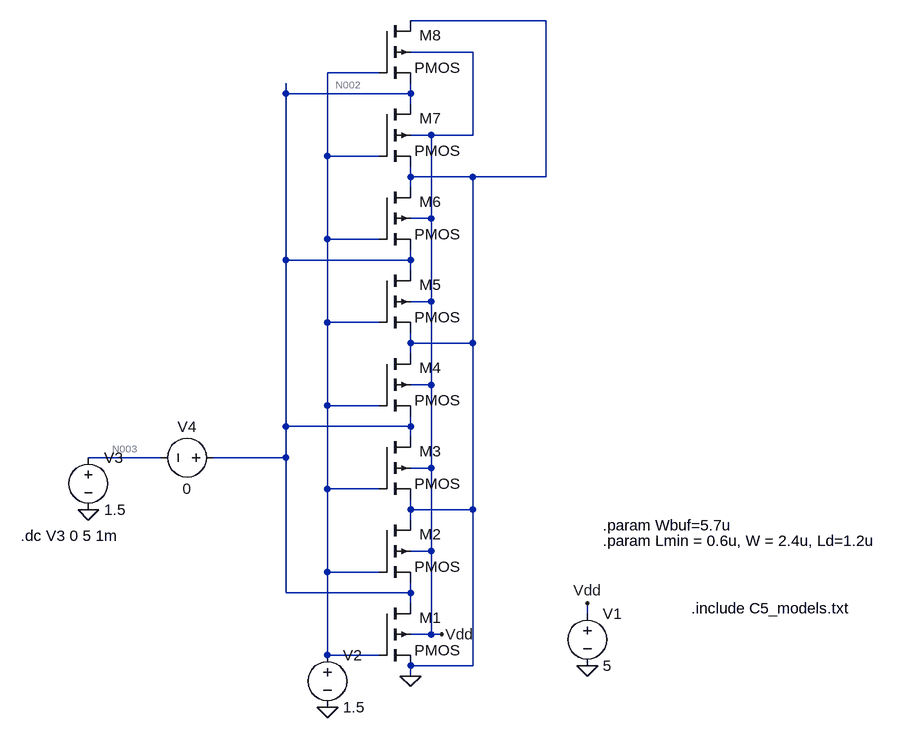
[diagram p0: schematic buffer.asc]
buffer.asc, the LTspice schematic file:
Version 4
SHEET 1 1016 680
WIRE 464 -768 256 -768
WIRE 352 -720 256 -720
WIRE 208 -688 128 -688
WIRE 64 -656 64 -672
WIRE 256 -656 256 -672
WIRE 256 -656 64 -656
WIRE 256 -640 256 -656
WIRE 288 -592 256 -592
WIRE 352 -592 352 -720
WIRE 352 -592 288 -592
WIRE 128 -560 128 -688
WIRE 208 -560 128 -560
WIRE 256 -528 256 -544
WIRE 352 -528 256 -528
WIRE 464 -528 464 -768
WIRE 464 -528 352 -528
WIRE 256 -512 256 -528
WIRE 288 -464 288 -592
WIRE 288 -464 256 -464
WIRE 128 -432 128 -560
WIRE 208 -432 128 -432
WIRE 64 -400 64 -656
WIRE 256 -400 256 -416
WIRE 256 -400 64 -400
WIRE 256 -384 256 -400
WIRE 288 -336 288 -464
WIRE 288 -336 256 -336
WIRE 128 -304 128 -432
WIRE 208 -304 128 -304
WIRE 256 -272 256 -288
WIRE 352 -272 352 -528
WIRE 352 -272 256 -272
WIRE 256 -256 256 -272
WIRE 288 -208 288 -336
WIRE 288 -208 256 -208
WIRE 128 -176 128 -304
WIRE 208 -176 128 -176
WIRE 64 -144 64 -400
WIRE 256 -144 256 -160
WIRE 256 -144 64 -144
WIRE 256 -128 256 -144
WIRE -128 -96 -240 -96
WIRE 64 -96 64 -144
WIRE 64 -96 -48 -96
WIRE 288 -80 288 -208
WIRE 288 -80 256 -80
WIRE 128 -48 128 -176
WIRE 208 -48 128 -48
WIRE 256 -16 256 -32
WIRE 352 -16 352 -272
WIRE 352 -16 256 -16
WIRE 256 0 256 -16
WIRE 288 48 288 -80
WIRE 288 48 256 48
WIRE 128 80 128 -48
WIRE 208 80 128 80
WIRE 64 112 64 -96
WIRE 256 112 256 96
WIRE 256 112 64 112
WIRE 256 128 256 112
WIRE 528 144 528 128
WIRE 288 176 288 48
WIRE 288 176 256 176
WIRE 304 176 288 176
WIRE 128 208 128 80
WIRE 208 208 128 208
WIRE 352 224 352 -16
WIRE 352 224 256 224
WIRE 256 240 256 224
FLAG 304 176 Vdd
FLAG 256 240 0
FLAG 528 224 0
FLAG 528 128 Vdd
FLAG 128 288 0
FLAG -240 -16 0
SYMBOL pmos4 208 128 R0
WINDOW 0 62 22 Left 2
WINDOW 3 54 72 Left 2
SYMATTR InstName M1
SYMATTR Value2 l='Lmin' w='Wbuf' ad='Ld*Wbuf' as='Ld*Wbuf' pd='2*Ld+2*Wbuf' ps='2*Ld+2*Wbuf' m=1
SYMBOL voltage 528 128 R0
SYMATTR InstName V1
SYMATTR Value 5
SYMBOL voltage 128 192 R0
SYMATTR InstName V2
SYMATTR Value 1.5
SYMBOL voltage -240 -112 R0
SYMATTR InstName V3
SYMATTR Value 1.5
SYMBOL pmos4 208 0 R0
WINDOW 0 62 22 Left 2
WINDOW 3 54 72 Left 2
SYMATTR InstName M2
SYMATTR Value2 l='Lmin' w='Wbuf' ad='Ld*Wbuf' as='Ld*Wbuf' pd='2*Ld+2*Wbuf' ps='2*Ld+2*Wbuf' m=1
SYMBOL pmos4 208 -128 R0
WINDOW 0 62 22 Left 2
WINDOW 3 54 72 Left 2
SYMATTR InstName M3
SYMATTR Value2 l='Lmin' w='Wbuf' ad='Ld*Wbuf' as='Ld*Wbuf' pd='2*Ld+2*Wbuf' ps='2*Ld+2*Wbuf' m=1
SYMBOL pmos4 208 -256 R0
WINDOW 0 62 22 Left 2
WINDOW 3 54 72 Left 2
SYMATTR InstName M4
SYMATTR Value2 l='Lmin' w='Wbuf' ad='Ld*Wbuf' as='Ld*Wbuf' pd='2*Ld+2*Wbuf' ps='2*Ld+2*Wbuf' m=1
SYMBOL pmos4 208 -384 R0
WINDOW 0 62 22 Left 2
WINDOW 3 54 72 Left 2
SYMATTR InstName M5
SYMATTR Value2 l='Lmin' w='Wbuf' ad='Ld*Wbuf' as='Ld*Wbuf' pd='2*Ld+2*Wbuf' ps='2*Ld+2*Wbuf' m=1
SYMBOL pmos4 208 -512 R0
WINDOW 0 62 22 Left 2
WINDOW 3 54 72 Left 2
SYMATTR InstName M6
SYMATTR Value2 l='Lmin' w='Wbuf' ad='Ld*Wbuf' as='Ld*Wbuf' pd='2*Ld+2*Wbuf' ps='2*Ld+2*Wbuf' m=1
SYMBOL pmos4 208 -640 R0
WINDOW 0 62 22 Left 2
WINDOW 3 54 72 Left 2
SYMATTR InstName M7
SYMATTR Value2 l='Lmin' w='Wbuf' ad='Ld*Wbuf' as='Ld*Wbuf' pd='2*Ld+2*Wbuf' ps='2*Ld+2*Wbuf' m=1
SYMBOL voltage -32 -96 R90
WINDOW 0 -32 56 VBottom 2
WINDOW 3 32 56 VTop 2
SYMATTR InstName V4
SYMATTR Value 0
SYMBOL pmos4 208 -768 R0
WINDOW 0 62 22 Left 2
WINDOW 3 54 72 Left 2
SYMATTR InstName M8
SYMATTR Value2 l='Lmin' w='Wbuf' ad='Ld*Wbuf' as='Ld*Wbuf' pd='2*Ld+2*Wbuf' ps='2*Ld+2*Wbuf' m=1
TEXT -344 24 Left 2 !.dc V3 0 5 1m
TEXT 552 8 Left 2 !.param Wbuf=5.7u
TEXT 552 32 Left 2 !.param Lmin = 0.6u, W = 2.4u, Ld=1.2u
TEXT 688 136 Left 2 !.include C5_models.txt

The netlist it stands for:
* buffer.asc
M1 N002 N001 0 Vdd PMOS l='Lmin' w='Wbuf' ad='Ld*Wbuf' as='Ld*Wbuf' pd='2*Ld+2*Wbuf' ps='2*Ld+2*Wbuf' m=1
V1 Vdd 0 5
V2 N001 0 1.5
V3 N003 0 1.5
M2 0 N001 N002 Vdd PMOS l='Lmin' w='Wbuf' ad='Ld*Wbuf' as='Ld*Wbuf' pd='2*Ld+2*Wbuf' ps='2*Ld+2*Wbuf' m=1
M3 N002 N001 0 Vdd PMOS l='Lmin' w='Wbuf' ad='Ld*Wbuf' as='Ld*Wbuf' pd='2*Ld+2*Wbuf' ps='2*Ld+2*Wbuf' m=1
M4 0 N001 N002 Vdd PMOS l='Lmin' w='Wbuf' ad='Ld*Wbuf' as='Ld*Wbuf' pd='2*Ld+2*Wbuf' ps='2*Ld+2*Wbuf' m=1
M5 N002 N001 0 Vdd PMOS l='Lmin' w='Wbuf' ad='Ld*Wbuf' as='Ld*Wbuf' pd='2*Ld+2*Wbuf' ps='2*Ld+2*Wbuf' m=1
M6 0 N001 N002 Vdd PMOS l='Lmin' w='Wbuf' ad='Ld*Wbuf' as='Ld*Wbuf' pd='2*Ld+2*Wbuf' ps='2*Ld+2*Wbuf' m=1
M7 N002 N001 0 Vdd PMOS l='Lmin' w='Wbuf' ad='Ld*Wbuf' as='Ld*Wbuf' pd='2*Ld+2*Wbuf' ps='2*Ld+2*Wbuf' m=1
V4 N002 N003 0
M8 0 N001 N002 Vdd PMOS l='Lmin' w='Wbuf' ad='Ld*Wbuf' as='Ld*Wbuf' pd='2*Ld+2*Wbuf' ps='2*Ld+2*Wbuf' m=1
.model NMOS NMOS
.model PMOS PMOS
.lib standard.mos
.dc V3 0 5 1m
.param Wbuf=5.7u
.param Lmin = 0.6u, W = 2.4u, Ld=1.2u
.include C5_models.txt
.backanno
.end

* Results of the author's LTspice run, read from the files saved beside the schematic
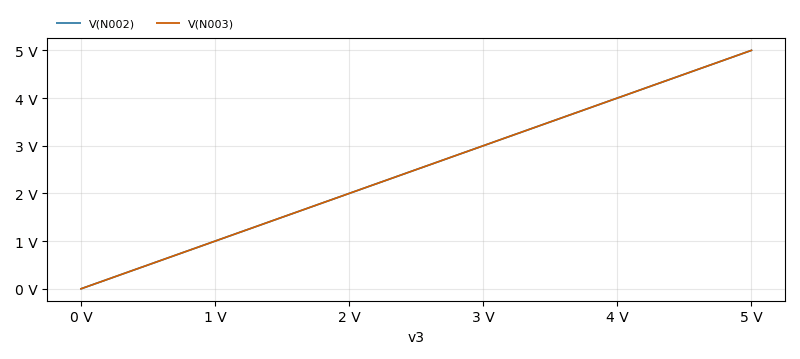
[diagram p1: DC transfer characteristic of buffer.asc, plotted from the saved traces]
* DC transfer characteristic, 1 run:
*   V(N002): 0 V at v3=0 V, 5 V at v3=5 V, min 0 V, max 5 V
*   V(N003): 0 V at v3=0 V, 5 V at v3=5 V, min 0 V, max 5 V